# Altium schematic sheet MacSet-L-V2.0.0_3.SchDoc
size A4; SheetNumber: 3; SheetTotal: 3
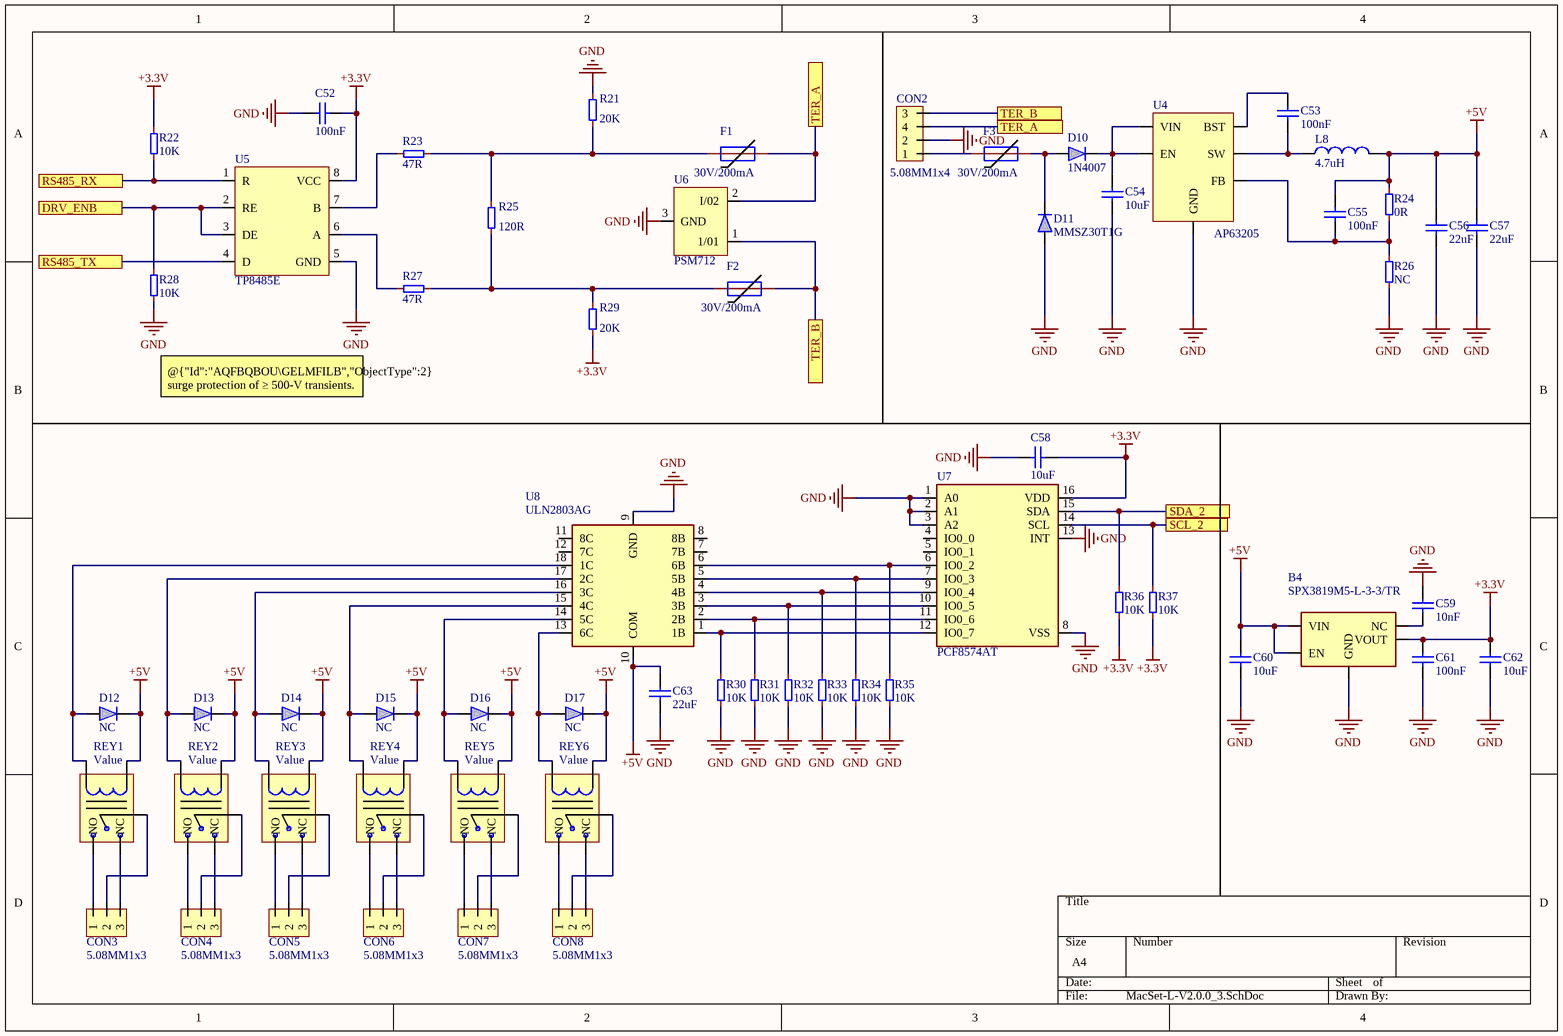
[diagram p0: MacSet-L-V2.0.0_3.SchDoc]

## Parts
B4  SPX3819M5-L-3-3/TR  [SOT95P285X140-5N]
C52  100nF  [CAP0402]
C53  100nF  [CAP0402]
C54  10uF  [CAP0805]
C55  100nF  [CAP0402]
C56  22uF  [CAP0805]
C57  22uF  [CAP0805]
C58  10uF  [CAP0603]
C59  10nF  [CAP0402]
C60  10uF  [CAP0603]
C61  100nF  [CAP0402]
C62  10uF  [CAP0603]
C63  22uF  [CAP0805]
CON2  5.08MM1x4  [Screw Terminal Block 5.08x4]
CON3  5.08MM1x3  [Screw Terminal Block 5.08x3]
CON4  5.08MM1x3  [Screw Terminal Block 5.08x3]
CON5  5.08MM1x3  [Screw Terminal Block 5.08x3]
CON6  5.08MM1x3  [Screw Terminal Block 5.08x3]
CON7  5.08MM1x3  [Screw Terminal Block 5.08x3]
CON8  5.08MM1x3  [Screw Terminal Block 5.08x3]
D10  1N4007  [Diode SMD 214AC]
D11  MMSZ30T1G  [SOD123-2]
D12  NC  [Diode SMD 214AC]
D13  NC  [Diode SMD 214AC]
D14  NC  [Diode SMD 214AC]
D15  NC  [Diode SMD 214AC]
D16  NC  [Diode SMD 214AC]
D17  NC  [Diode SMD 214AC]
F1  30V/200mA  [FUSE_1206]
F2  30V/200mA  [FUSE_1206]
F3  30V/200mA  [FUSE_1206]
L8  4.7uH  [IND_3x3x1.5MM]
R21  20K  [RESC0402]
R22  10K  [RESC0402]
R23  47R  [RESC0603]
R24  0R  [RESC0402]
R25  value 120R  [RESC0402]  (hidden comment: NC)
R26  NC  [RESC0402]
R27  47R  [RESC0603]
R28  10K  [RESC0402]
R29  20K  [RESC0402]
R30  10K  [RESC0402]
R31  10K  [RESC0402]
R32  10K  [RESC0402]
R33  10K  [RESC0402]
R34  10K  [RESC0402]
R35  10K  [RESC0402]
R36  10K  [RESC0402]
R37  10K  [RESC0402]
REY1  Value  [Relay]
REY2  Value  [Relay]
REY3  Value  [Relay]
REY4  Value  [Relay]
REY5  Value  [Relay]
REY6  Value  [Relay]
U4  AP63205  [SOT23-6]
U5  TP8485E  [SOIC8]
U6  PSM712  [SOT23]
U7  PCF8574AT  [SOIC-16-W]
U8  ULN2803AG  [SOIC-18-W]

## Ports
DRV_ENB (see MacSet-L-V2.0.0_2[4A]), RS485_RX (see MacSet-L-V2.0.0_2[4A]), RS485_TX (see MacSet-L-V2.0.0_2[4A]), SCL_2 (see MacSet-L-V2.0.0_2[3A]), SDA_2 (see MacSet-L-V2.0.0_2[3B]), TER_A (see MacSet-L-V2.0.0_3[3A]), TER_B (see MacSet-L-V2.0.0_3[3A]), TER_B (see MacSet-L-V2.0.0_3[3B])

## Nets
+3.3V: B4.5(VOUT) C52.2 C58.2 C61.2 C62.2 R22.2 R29.1 R36.1 R37.1 U5.8(VCC) U7.16(VDD)
+5V: B4.1(VIN) B4.3(EN) C55.2 C56.2 C57.2 C60.2 C63.1 D12.1(K) D13.1(K) D14.1(K) D15.1(K) D16.1(K) D17.1(K) L8.2 R24.1 REY1.1(+) REY2.1(+) REY3.1(+) REY4.1(+) REY5.1(+) REY6.1(+) U8.10(COM)
GND: B4.2(GND) C52.1 C54.1 C56.1 C57.1 C58.1 C59.1 C60.1 C61.1 C62.1 C63.2 CON2.2 D11.2(A) R21.2 R26.2 R28.1 R30.1 R31.1 R32.1 R33.1 R34.1 R35.1 U4.4(GND) U5.5(GND) U6.3(GND) U7.1(A0) U7.2(A1) U7.3(A2) U7.8(VSS) U7.13(INT) U8.9(GND)
DRV_ENB: R28.2 U5.2(RE) U5.3(DE) ; port DRV_ENB
RS485_RX: R22.1 U5.1(R) ; port RS485_RX
RS485_TX: U5.4(D) ; port RS485_TX
SCL_2: R37.2 U7.14(SCL) ; port SCL_2
SDA_2: R36.2 U7.15(SDA) ; port SDA_2
TER_A: CON2.4 F1.2 U6.2(I/02) ; port TER_A
TER_B: CON2.3 F2.2 U6.1(1/01) ; port TER_B
NetB4_4: B4.4(NC) C59.2
NetC53_1: C53.1 L8.1 U4.5(SW)
NetC53_2: C53.2 U4.6(BST)
NetC54_2: C54.2 D10.1(K) U4.2(EN) U4.3(VIN)
NetC55_1: C55.1 R24.2 R26.1 U4.1(FB)
NetCON2_1: CON2.1 F3.1
NetCON3_1: CON3.1 REY1.4(NO)
NetCON3_2: CON3.2 REY1.2(CM)
NetCON3_3: CON3.3 REY1.5(NC)
NetCON4_1: CON4.1 REY2.4(NO)
NetCON4_2: CON4.2 REY2.2(CM)
NetCON4_3: CON4.3 REY2.5(NC)
NetCON5_1: CON5.1 REY3.4(NO)
NetCON5_2: CON5.2 REY3.2(CM)
NetCON5_3: CON5.3 REY3.5(NC)
NetCON6_1: CON6.1 REY4.4(NO)
NetCON6_2: CON6.2 REY4.2(CM)
NetCON6_3: CON6.3 REY4.5(NC)
NetCON7_1: CON7.1 REY5.4(NO)
NetCON7_2: CON7.2 REY5.2(CM)
NetCON7_3: CON7.3 REY5.5(NC)
NetCON8_1: CON8.1 REY6.4(NO)
NetCON8_2: CON8.2 REY6.2(CM)
NetCON8_3: CON8.3 REY6.5(NC)
NetD10_2: D10.2(A) D11.1(K) F3.2
NetD12_2: D12.2(A) REY1.3(-) U8.18(1C)
NetD13_2: D13.2(A) REY2.3(-) U8.17(2C)
NetD14_2: D14.2(A) REY3.3(-) U8.16(3C)
NetD15_2: D15.2(A) REY4.3(-) U8.15(4C)
NetD16_2: D16.2(A) REY5.3(-) U8.14(5C)
NetD17_2: D17.2(A) REY6.3(-) U8.13(6C)
NetF1_1: F1.1 R21.1 R23.2 R25.2
NetF2_1: F2.1 R25.1 R27.2 R29.2
NetR23_1: R23.1 U5.7(B)
NetR27_1: R27.1 U5.6(A)
NetR30_2: R30.2 U7.12(IO0_7) U8.1(1B)
NetR31_2: R31.2 U7.11(IO0_6) U8.2(2B)
NetR32_2: R32.2 U7.10(IO0_5) U8.3(3B)
NetR33_2: R33.2 U7.9(IO0_4) U8.4(4B)
NetR34_2: R34.2 U7.7(IO0_3) U8.5(5B)
NetR35_2: R35.2 U7.6(IO0_2) U8.6(6B)

Not connected (* = marked no-connect by the designer): U7 4(IO0_0) 5(IO0_1); U8 7(7B) 8(8B) 11(8C) 12(7C)

## Notes on the sheet
- @{"Id":"AQFBQBOU\GELMFILB","ObjectType":2} surge protection of ≥ 500-V transients.

## Library data of the parts
B4 = SPX3819M5: Linear Voltage Regulator IC Positive Fixed 1 3.3V Output 500mA SOT-25; Manufacturer: MAX Linear; Manufacturer_Part_Number: SPX3819M5-L-3-3/TR; Supplier: *; Price: *
C52 = Capa_0402: Ceramic Capacitor X7R 0402 100nF 16V; Manufacturer_Part_Number: GRM155R71C104JA88D; Manufacturer: MURATA
C53 C55 = Capa_0402: Ceramic Capacitor C0G, NP0 0402 100nF 35V; Manufacturer_Part_Number: GRM155R61A104KA01J; Manufacturer: MURATA
C54 = Capa_0805: MLCC - SMD/SMT 10 uF 50VDC 10% 0805 X6S; Manufacturer_Part_Number: CC0805KKX5R9BB106; Manufacturer: YAGEO
C56 = Capa_0805: MLCC - SMD/SMT 22uF 10VDC 20% 0805 X6S; Manufacturer_Part_Number: CC0805KKX7R6BB226; Manufacturer: YAGEO
C57 C63 = Capa_0805: MLCC - SMD/SMT 22uF 10VDC 20% 0805 X6S; Manufacturer_Part_Number: CC0805KKX7R6BB226; Manufacturer: MURATA
C58 = CAP_0603: Ceramic Capacitor X5R 0603 10uF 10V; Manufacturer_Part_Number: CL10A106KP8NNNL; Manufacturer: SAMSUNG; Supplier: *; Package: 0603; Price: *
C59 = CAP_0402: Ceramic Capacitor X7R 0402 10nF 50V; Manufacturer_Part_Number: GCM155R71H103KA55J; Manufacturer: Murata; Supplier: ROBU; Package: 0402; Price: 0.15
C60 C62 = CAP_0603: Ceramic Capacitor X5R 0603 10uF 25V; Manufacturer_Part_Number: CL10A106MA8NRNC; Manufacturer: SAMSUNG; Supplier: ROBU; Package: 0603; Price: 1.8
C61 = CAP_0402: Ceramic Capacitor X7R 0402 100nF 50V; Manufacturer_Part_Number: CL05B104KA5NNNC; Manufacturer: SAMSUNG; Supplier: ROBU; Package: 0402; Price: 0.15
CON2 = Screw Terminal Block 4x1 5.08mm: 5.08mm 1*4 Screw Terminal Block; Manufacturer: XINYA; Manufacturer_Part_Number: *; Supplier: *; Price: *; Package: 1x4x3.5
CON3-CON8 = Screw Terminal Block 3x1 5.08mm: 5.08mm 1*3 Screw Terminal Block; Manufacturer_Part_Number: XY302V-3.5-3P; Manufacturer: XINYA; Supplier: ROBU; Price: 12; Package: 1x3x3.5
D10 D12-D17 = DIODE: Diode 1N4007 AO214AC; Manufacturer: GENERIC; Manufacturer_Part_Number: 1N4007; Supplier: *; Price: *; Package: AO214-AC
D11 = BAT54T1G: MMSZ30T1G 30V 500mW Schottky Diodes & Rectifiers; Manufacturer: Onsemi; Manufacturer_Part_Number: MMSZ30T1G
F1-F3 = FUSE_1206: Polymeric PTC Resettable Fuse 30V 200mA Surface Mount 1206; Manufacturer_Part_Number: nSMD020-30V; Manufacturer: TECHFUSE; Package: 1206
L8 = INDUCTOR: 1.09A 4.7uH ±3% 163mΩ 3015 Inductors; Manufacturer_Part_Number: SWPA3015S4R7MT; Manufacturer: SUNLORD; Package: 3015; Supplier: Evelta; Price: 6.9
R21 R29 = RES_0402: Resistor SMD 0402; Manufacturer_Part_Number: CRCW040220K0FKEDC; Manufacturer: YAGEO; Value: 20K
R22 R28 R30-R37 = RES_0402: Thick Film Resistors - SMD 1/16watt 10Kohms 0402 1% Commercial Use; Manufacturer_Part_Number: CRCW040210K0FKEDC; Manufacturer: Vishay; Parameter 1: *
R23 R27 = RES_0603: Thick Film Resistors - SMD 1/16Watt 47ohms 1% Commercial Use; Manufacturer_Part_Number: RC0402FR-0747RL; Manufacturer: Vishay; Parameter 1: *
R24 = RES_0402: Thick Film Resistors - SMD 1/16watt 0R 1% 0402 Commercial Use; Manufacturer_Part_Number: RC0402FR-070RL; Manufacturer: Vishay; Parameter 1: *
R25 = RES_0402: Resistor SMD 0402; Manufacturer_Part_Number: *; Manufacturer: *
R26 = RES_0402: Thick Film Resistors - SMD 1/16watt 10Kohms 0.1% 0402 Commercial Use; Manufacturer_Part_Number: MCS04020D1002BE000; Manufacturer: Vishay; Parameter 1: *
REY1-REY6 = Relay: 5V Sugar Cube Relay 44mA
U4 = AP63205: AP63205 - Switching Voltage Regulators 5V OUT DCDC 3.8V-32V Conv HV Buck TSOT26 T&R 3K; Manufacturer_Part_Number: AP63205QWU-7; Manufacturer: Diodes Incorporated; Price: *
U5 = TP8485E: TP8485E RS485 Tranreciver 3V-5.5V SOIC8; Manufacturer: 3PEAK; Manufacturer_Part_Number: TP8485
U6 = PSM712: Asymmerical TVS Diode for Extended Common-Mode RS-485; Manufacturer_Part_Number: SM712H-TP-B002; Manufacturer: Micro Commercial Components (MCC)
U7 = PCF8574AT: PCF8574AT 8Bit I2C GPIO Expander 16 Pin; Manufacturer: NXP Semiconductors; Manufacturer_Part_Number: PCF8574AT; Package: SOIC-16
U8 = ULN2803AG: ULN2803C device is a 50V, 500mA Darlington / transistor array; Manufacturer: UMW; Manufacturer_Part_Number: ULN2803A; Package: SOIC-18